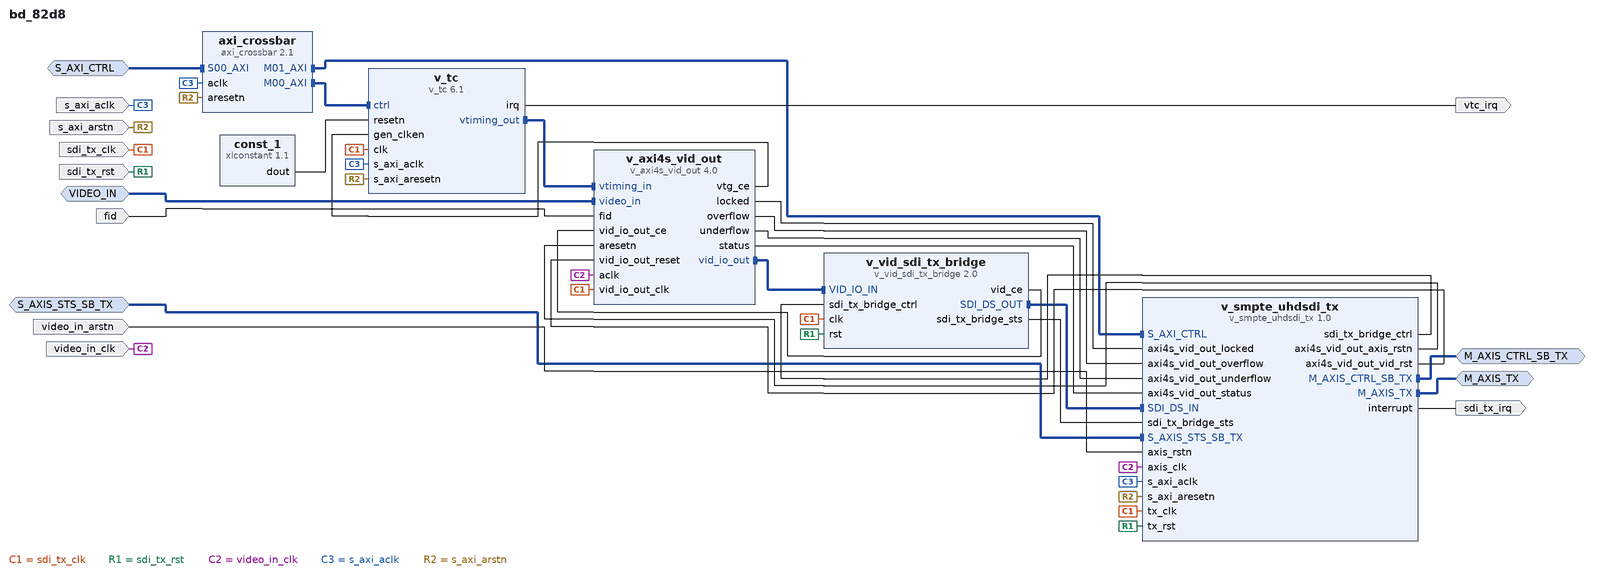
[diagram p0: block diagram of the top level]
# Vivado block design bd_82d8, xczu7ev-fbvb900-1-i, Vivado 2018.2
create_bd_design bd_82d8

create_bd_intf_port -mode Master -vlnv xilinx.com:interface:axis_rtl:1.0 M_AXIS_TX
set_property -dict {CONFIG.TDATA_NUM_BYTES 5 CONFIG.TUSER_WIDTH 32} [get_bd_intf_ports M_AXIS_TX]
create_bd_intf_port -mode Master -vlnv xilinx.com:interface:axis_rtl:1.0 M_AXIS_CTRL_SB_TX
create_bd_intf_port -mode Slave -vlnv xilinx.com:interface:axis_rtl:1.0 S_AXIS_STS_SB_TX
create_bd_intf_port -mode Slave -vlnv xilinx.com:interface:axis_rtl:1.0 VIDEO_IN
create_bd_intf_port -mode Slave -vlnv xilinx.com:interface:aximm_rtl:1.0 S_AXI_CTRL
set_property -dict {CONFIG.PROTOCOL AXI4LITE CONFIG.ADDR_WIDTH 17} [get_bd_intf_ports S_AXI_CTRL]
create_bd_port -dir I -type clk sdi_tx_clk
set_property -dict {CONFIG.ASSOCIATED_RESET sdi_tx_rst} [get_bd_ports sdi_tx_clk]
create_bd_port -dir I -type rst sdi_tx_rst
create_bd_port -dir I -type clk video_in_clk
set_property -dict {CONFIG.ASSOCIATED_RESET video_in_arstn} [get_bd_ports video_in_clk]
create_bd_port -dir I -type rst video_in_arstn
set_property -dict {CONFIG.POLARITY ACTIVE_LOW} [get_bd_ports video_in_arstn]
create_bd_port -dir I fid
create_bd_port -dir O -type intr vtc_irq
create_bd_port -dir O -type intr sdi_tx_irq
create_bd_port -dir I -type clk s_axi_aclk
set_property -dict {CONFIG.ASSOCIATED_RESET s_axi_arstn} [get_bd_ports s_axi_aclk]
create_bd_port -dir I -type rst s_axi_arstn
set_property -dict {CONFIG.POLARITY ACTIVE_LOW} [get_bd_ports s_axi_arstn]

create_bd_cell -type ip -vlnv xilinx.com:ip:axi_crossbar:2.1 axi_crossbar
set_property -dict [list \
  CONFIG.ADDR_WIDTH 17 \
  CONFIG.PROTOCOL AXI4LITE \
  CONFIG.R_REGISTER 1 \
  CONFIG.M00_A00_BASE_ADDR 0x0000000000010000 \
  CONFIG.M01_A00_BASE_ADDR 0x0000000000000000 \
  CONFIG.M00_A00_ADDR_WIDTH 16 \
  CONFIG.M01_A00_ADDR_WIDTH 16 \
] [get_bd_cells axi_crossbar]
create_bd_cell -type ip -vlnv xilinx.com:ip:v_smpte_uhdsdi_tx:1.0 v_smpte_uhdsdi_tx
set_property -dict [list \
  CONFIG.C_LINE_RATE 12G_SDI_8DS \
  CONFIG.C_AXI4LITE_ENABLE true \
  CONFIG.C_ADV_FEATURE false \
  CONFIG.C_INCLUDE_VID_OVER_AXI true \
  CONFIG.C_INCLUDE_SDI_BRIDGE true \
  CONFIG.C_INCLUDE_TX_EDH_PROCESSOR true \
] [get_bd_cells v_smpte_uhdsdi_tx]
create_bd_cell -type ip -vlnv xilinx.com:ip:v_vid_sdi_tx_bridge:2.0 v_vid_sdi_tx_bridge
set_property -dict [list \
  CONFIG.C_PIXELS_PER_CLOCK 2 \
  CONFIG.C_INCLUDE_3G_SDI_BRIDGE true \
  CONFIG.C_INCLUDE_12G_SDI_BRIDGE true \
  CONFIG.C_ADV_FEATURE false \
] [get_bd_cells v_vid_sdi_tx_bridge]
create_bd_cell -type ip -vlnv xilinx.com:ip:v_axi4s_vid_out:4.0 v_axi4s_vid_out
set_property -dict [list \
  CONFIG.C_PIXELS_PER_CLOCK 2 \
  CONFIG.C_S_AXIS_VIDEO_DATA_WIDTH 10 \
  CONFIG.C_NATIVE_COMPONENT_WIDTH 10 \
  CONFIG.C_HAS_ASYNC_CLK 1 \
] [get_bd_cells v_axi4s_vid_out]
create_bd_cell -type ip -vlnv xilinx.com:ip:v_tc:6.1 v_tc
set_property -dict [list \
  CONFIG.INTERLACE_EN true \
  CONFIG.VIDEO_MODE Custom \
  CONFIG.GEN_INTERLACED true \
  CONFIG.enable_detection false \
  CONFIG.GEN_FIELDID_EN true \
] [get_bd_cells v_tc]
create_bd_cell -type ip -vlnv xilinx.com:ip:xlconstant:1.1 const_1

# ---- connections ----

connect_bd_intf_net [get_bd_intf_pins v_vid_sdi_tx_bridge/SDI_DS_OUT] [get_bd_intf_pins v_smpte_uhdsdi_tx/SDI_DS_IN]
connect_bd_intf_net [get_bd_intf_pins v_smpte_uhdsdi_tx/S_AXI_CTRL] [get_bd_intf_pins axi_crossbar/M01_AXI]
connect_bd_intf_net [get_bd_intf_pins v_vid_sdi_tx_bridge/VID_IO_IN] [get_bd_intf_pins v_axi4s_vid_out/vid_io_out]
connect_bd_intf_net [get_bd_intf_pins v_axi4s_vid_out/vtiming_in] [get_bd_intf_pins v_tc/vtiming_out]
connect_bd_intf_net [get_bd_intf_pins axi_crossbar/M00_AXI] [get_bd_intf_pins v_tc/ctrl]
connect_bd_intf_net [get_bd_intf_ports M_AXIS_TX] [get_bd_intf_pins v_smpte_uhdsdi_tx/M_AXIS_TX]
connect_bd_intf_net [get_bd_intf_ports M_AXIS_CTRL_SB_TX] [get_bd_intf_pins v_smpte_uhdsdi_tx/M_AXIS_CTRL_SB_TX]
connect_bd_intf_net [get_bd_intf_ports S_AXIS_STS_SB_TX] [get_bd_intf_pins v_smpte_uhdsdi_tx/S_AXIS_STS_SB_TX]
connect_bd_intf_net [get_bd_intf_ports VIDEO_IN] [get_bd_intf_pins v_axi4s_vid_out/video_in]
connect_bd_intf_net [get_bd_intf_ports S_AXI_CTRL] [get_bd_intf_pins axi_crossbar/S00_AXI]
connect_bd_net [get_bd_pins v_smpte_uhdsdi_tx/sdi_tx_bridge_ctrl] [get_bd_pins v_vid_sdi_tx_bridge/sdi_tx_bridge_ctrl]
connect_bd_net [get_bd_pins v_vid_sdi_tx_bridge/sdi_tx_bridge_sts] [get_bd_pins v_smpte_uhdsdi_tx/sdi_tx_bridge_sts]
connect_bd_net [get_bd_ports sdi_tx_clk] \
  [get_bd_pins v_vid_sdi_tx_bridge/clk] [get_bd_pins v_smpte_uhdsdi_tx/tx_clk] [get_bd_pins v_tc/clk] \
  [get_bd_pins v_axi4s_vid_out/vid_io_out_clk]
connect_bd_net [get_bd_ports sdi_tx_rst] [get_bd_pins v_vid_sdi_tx_bridge/rst] [get_bd_pins v_smpte_uhdsdi_tx/tx_rst]
connect_bd_net [get_bd_pins const_1/dout] [get_bd_pins v_tc/resetn]
connect_bd_net [get_bd_ports video_in_clk] [get_bd_pins v_smpte_uhdsdi_tx/axis_clk] [get_bd_pins v_axi4s_vid_out/aclk]
connect_bd_net [get_bd_ports video_in_arstn] [get_bd_pins v_smpte_uhdsdi_tx/axis_rstn]
connect_bd_net [get_bd_pins v_axi4s_vid_out/locked] [get_bd_pins v_smpte_uhdsdi_tx/axi4s_vid_out_locked]
connect_bd_net [get_bd_pins v_axi4s_vid_out/overflow] [get_bd_pins v_smpte_uhdsdi_tx/axi4s_vid_out_overflow]
connect_bd_net [get_bd_pins v_axi4s_vid_out/underflow] [get_bd_pins v_smpte_uhdsdi_tx/axi4s_vid_out_underflow]
connect_bd_net [get_bd_pins v_axi4s_vid_out/status] [get_bd_pins v_smpte_uhdsdi_tx/axi4s_vid_out_status]
connect_bd_net [get_bd_pins v_smpte_uhdsdi_tx/axi4s_vid_out_axis_rstn] [get_bd_pins v_axi4s_vid_out/aresetn]
connect_bd_net [get_bd_pins v_smpte_uhdsdi_tx/axi4s_vid_out_vid_rst] [get_bd_pins v_axi4s_vid_out/vid_io_out_reset]
connect_bd_net [get_bd_pins v_tc/irq] [get_bd_ports vtc_irq]
connect_bd_net [get_bd_ports s_axi_aclk] [get_bd_pins v_tc/s_axi_aclk] [get_bd_pins axi_crossbar/aclk] [get_bd_pins v_smpte_uhdsdi_tx/s_axi_aclk]
connect_bd_net [get_bd_pins v_axi4s_vid_out/vtg_ce] [get_bd_pins v_tc/gen_clken]
connect_bd_net [get_bd_ports s_axi_arstn] \
  [get_bd_pins v_tc/s_axi_aresetn] [get_bd_pins axi_crossbar/aresetn] [get_bd_pins v_smpte_uhdsdi_tx/s_axi_aresetn]
connect_bd_net [get_bd_pins v_vid_sdi_tx_bridge/vid_ce] [get_bd_pins v_axi4s_vid_out/vid_io_out_ce]
connect_bd_net [get_bd_ports fid] [get_bd_pins v_axi4s_vid_out/fid]
connect_bd_net [get_bd_pins v_smpte_uhdsdi_tx/interrupt] [get_bd_ports sdi_tx_irq]

# ---- address map ----
assign_bd_address -offset 0x00000 -range 64K -target_address_space [get_bd_addr_spaces S_AXI_CTRL] [get_bd_addr_segs v_smpte_uhdsdi_tx/S_AXI_CTRL/Reg]
assign_bd_address -offset 0x10000 -range 64K -target_address_space [get_bd_addr_spaces S_AXI_CTRL] [get_bd_addr_segs v_tc/ctrl/Reg]

validate_bd_design
save_bd_design
